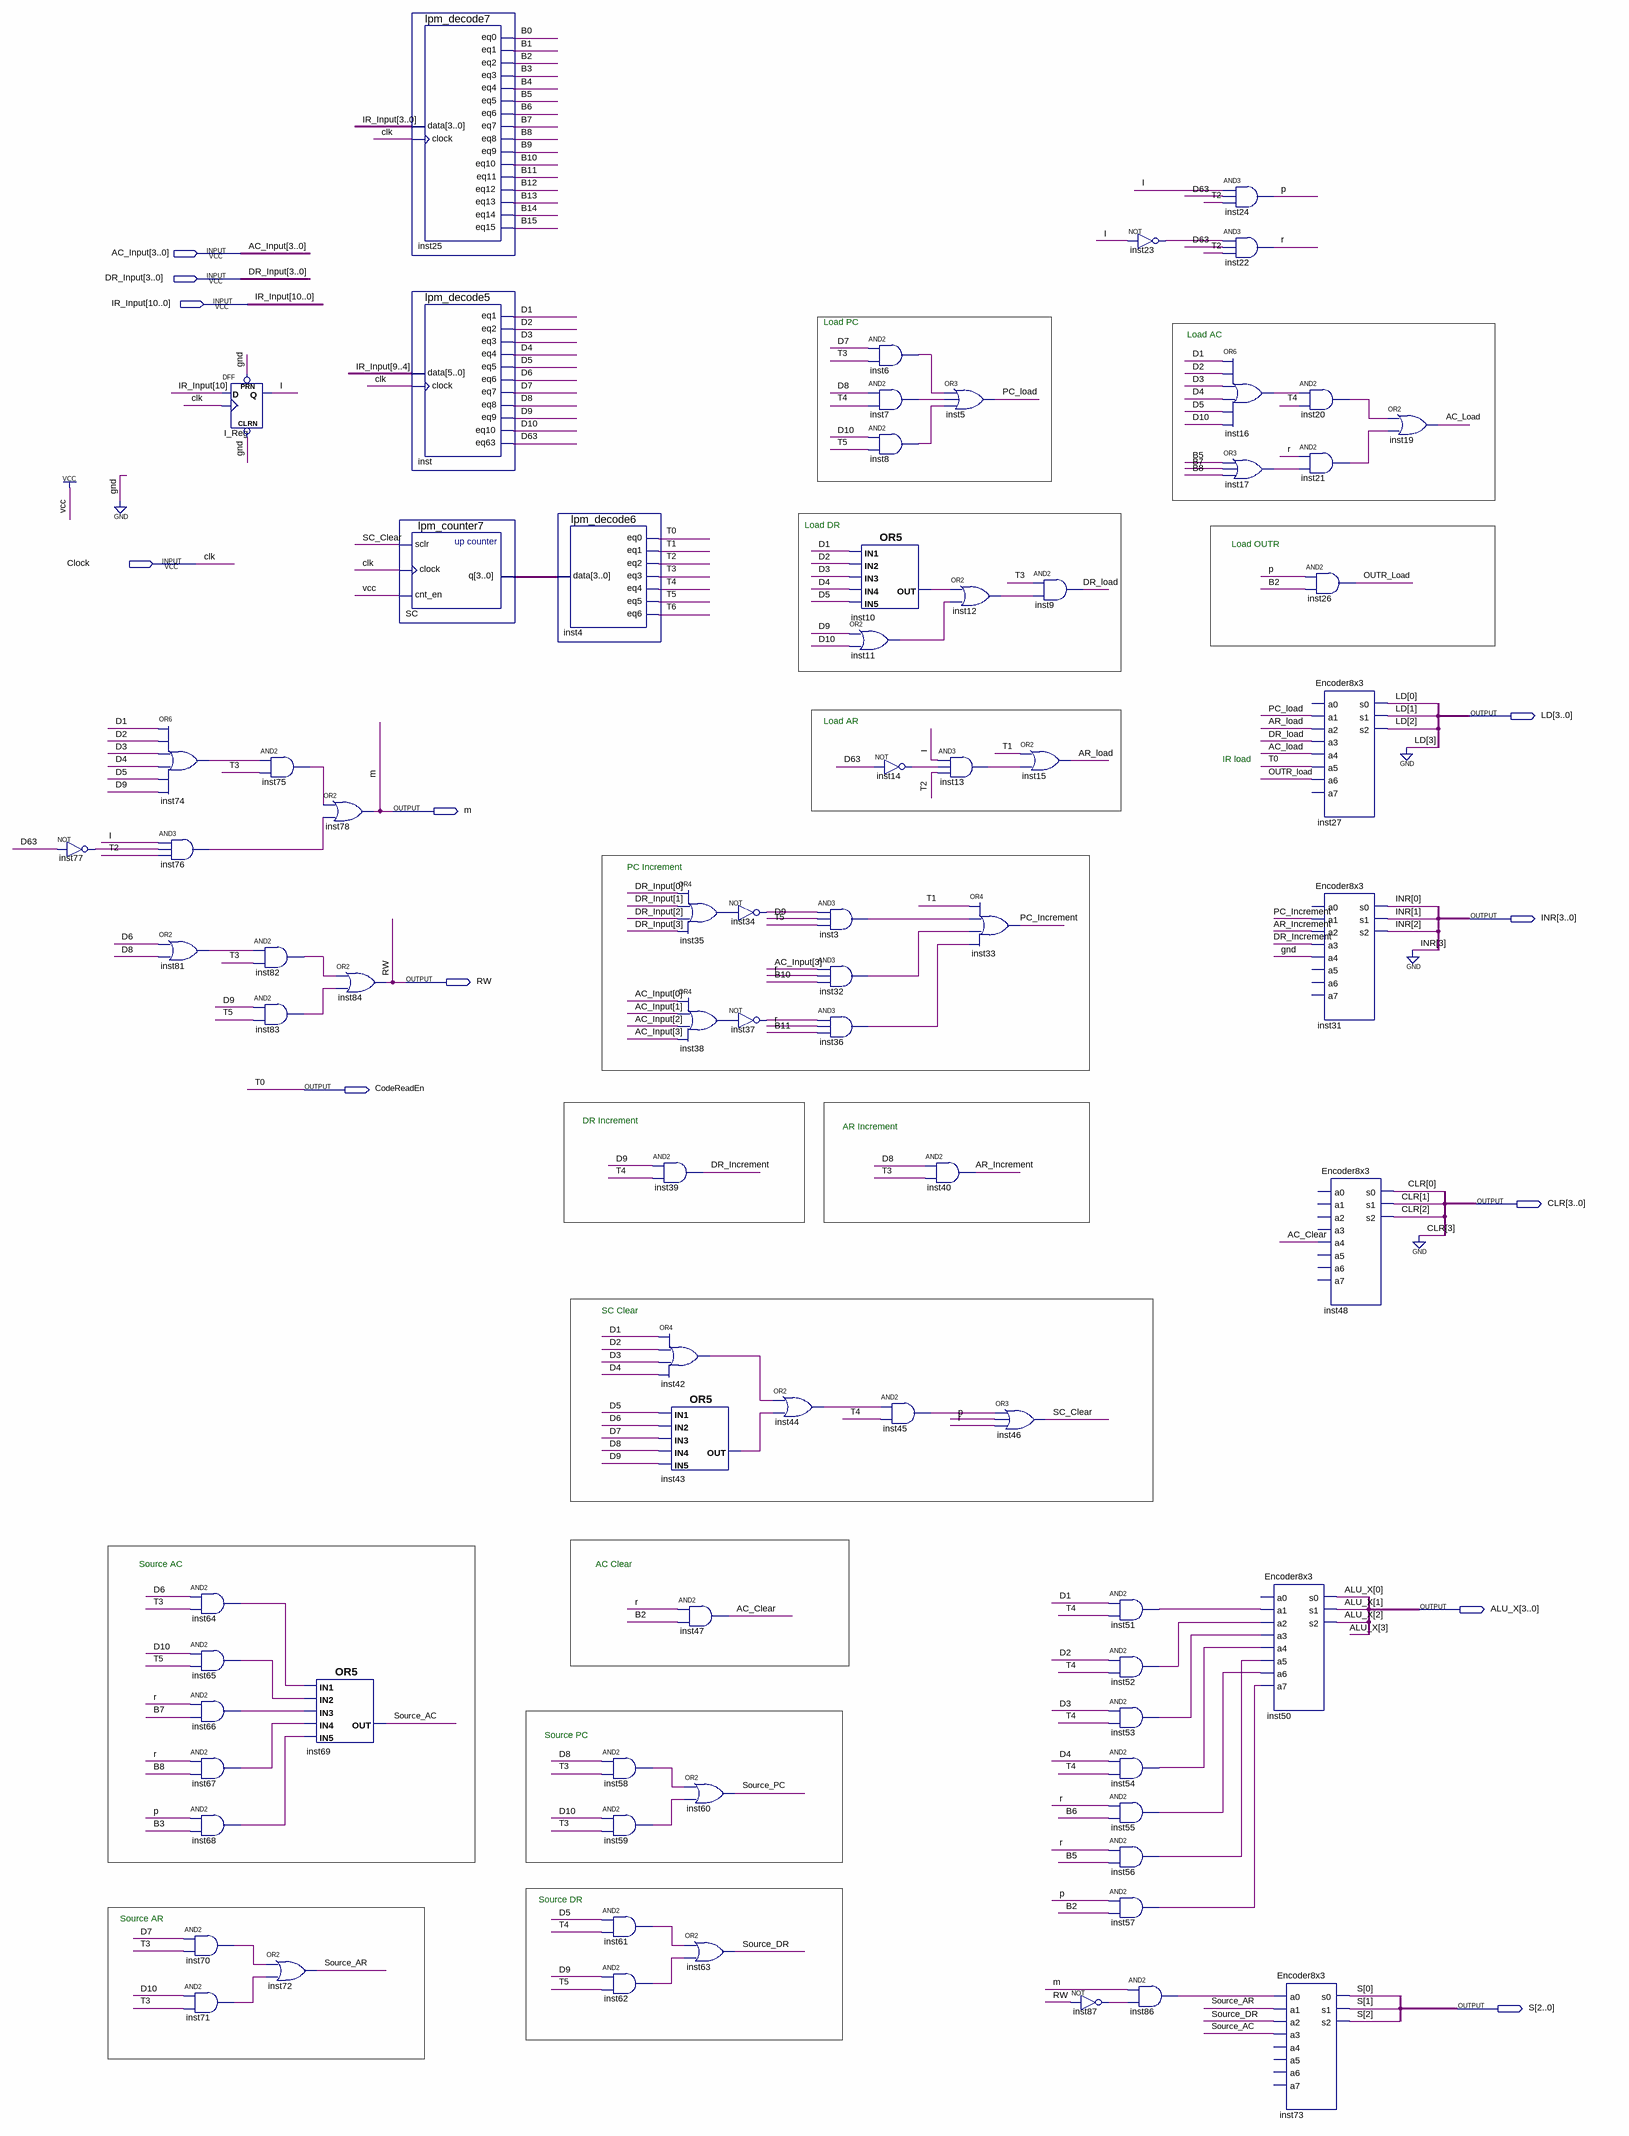
[diagram p0: schematic sheet]
// Quartus schematic CU.bdf as structural Verilog: 79 symbols, 12 pins
module CU (
  input  [3:0] AC_Input,
  input  [3:0] DR_Input,
  input  [10:0] IR_Input,
  input  Clock,
  output [3:0] LD,
  output m,
  output [3:0] INR,
  output RW,
  output CodeReadEn,
  output [3:0] CLR,
  output [3:0] ALU_X,
  output [2:0] S
);

  wire AC_Clear, AC_Load, AR_Increment, AR_load, B0, B1, B2, B3, B4, B5, B6, B7, B8, B9, B10, B11, B12, B13,
       B14, B15, D1, D2, D3, D4, D5, D6, D7, D8, D9, D10, D63, DR_Increment, DR_load, I, inst3_out,
       inst6_out, inst7_out, inst8_out, inst10_out, inst11_out, inst12_out, inst13_out, inst14_out,
       inst16_out, inst17_out, inst20_out, inst21_out, inst23_out, inst32_out, inst34_out, inst35_out,
       inst36_out, inst37_out, inst38_out, inst42_out, inst43_out, inst44_out, inst45_out, inst51_out,
       inst52_out, inst53_out, inst54_out, inst55_out, inst56_out, inst57_out, inst58_out, inst59_out,
       inst61_out, inst62_out, inst64_out, inst65_out, inst66_out, inst67_out, inst68_out, inst70_out,
       inst71_out, inst74_out, inst75_out, inst76_out, inst77_out, inst81_out, inst82_out, inst83_out,
       inst86_out, inst87_out, OUTR_Load, p, PC_Increment, PC_load, r, SC_Clear, Source_AC, Source_AR,
       Source_DR, Source_PC, T1, T2, T3, T4, T5, T6;
  wire [3:0] SC_q;

  not inst77 (inst77_out, D63);
  or inst74 (inst74_out, D1, D2, D3, D4, D5, D9);
  and inst76 (inst76_out, I, inst77_out, T2);
  or inst81 (inst81_out, D6, D8);
  and inst64 (inst64_out, D6, T3);
  and inst65 (inst65_out, D10, T5);
  and inst66 (inst66_out, r, B7);
  and inst67 (inst67_out, r, B8);
  and inst68 (inst68_out, p, B3);
  and inst70 (inst70_out, D7, T3);
  and inst71 (inst71_out, D10, T3);
  DFF I_Reg (.CLRN(1'b0), .CLK(Clock), .D(IR_Input[10]), .PRN(1'b0), .Q(I));
  and inst75 (inst75_out, inst74_out, T3);
  and inst82 (inst82_out, inst81_out, T3);
  and inst83 (inst83_out, D9, T5);
  or inst69 (Source_AC, inst64_out, inst65_out, inst66_out, inst67_out, inst68_out);
  or inst72 (Source_AR, inst70_out, inst71_out);
  or inst78 (m, inst75_out, inst76_out);
  or inst84 (RW, inst82_out, inst83_out);
  lpm_decode7 inst25 (
    .data(IR_Input[3:0]), .clock(Clock), .eq0(B0), .eq1(B1), .eq2(B2), .eq3(B3), .eq4(B4), .eq5(B5),
    .eq6(B6), .eq7(B7), .eq8(B8), .eq9(B9), .eq10(B10), .eq11(B11), .eq12(B12), .eq13(B13), .eq14(B14),
    .eq15(B15));
  lpm_decode5 inst (
    .data(IR_Input[9:4]), .clock(Clock), .eq1(D1), .eq2(D2), .eq3(D3), .eq4(D4), .eq5(D5), .eq6(D6),
    .eq7(D7), .eq8(D8), .eq9(D9), .eq10(D10), .eq63(D63));
  lpm_counter7 SC (.sclr(SC_Clear), .clock(Clock), .cnt_en(1'b1), .q(SC_q));
  lpm_decode6 inst4 (.data(SC_q), .eq0(CodeReadEn), .eq1(T1), .eq2(T2), .eq3(T3), .eq4(T4), .eq5(T5), .eq6(T6));
  and inst58 (inst58_out, D8, T3);
  and inst59 (inst59_out, D10, T3);
  and inst61 (inst61_out, D5, T4);
  and inst62 (inst62_out, D9, T5);
  and inst39 (DR_Increment, D9, T4);
  or inst42 (inst42_out, D1, D2, D3, D4);
  or inst43 (inst43_out, D5, D6, D7, D8, D9);
  or inst35 (inst35_out, DR_Input[0], DR_Input[1], DR_Input[2], DR_Input[3]);
  or inst38 (inst38_out, AC_Input[0], AC_Input[1], AC_Input[2], AC_Input[3]);
  and inst47 (AC_Clear, r, B2);
  or inst60 (Source_PC, inst58_out, inst59_out);
  or inst63 (Source_DR, inst61_out, inst62_out);
  not inst34 (inst34_out, inst35_out);
  not inst37 (inst37_out, inst38_out);
  and inst3 (inst3_out, inst34_out, D9, T5);
  and inst32 (inst32_out, AC_Input[3], r, B10);
  and inst36 (inst36_out, inst37_out, r, B11);
  or inst44 (inst44_out, inst42_out, inst43_out);
  and inst6 (inst6_out, D7, T3);
  and inst7 (inst7_out, D8, T4);
  and inst8 (inst8_out, D10, T5);
  or inst10 (inst10_out, D1, D2, D3, D4, D5);
  or inst11 (inst11_out, D9, D10);
  not inst14 (inst14_out, D63);
  and inst45 (inst45_out, inst44_out, T4);
  or inst5 (PC_load, inst6_out, inst7_out, inst8_out);
  or inst12 (inst12_out, inst10_out, inst11_out);
  and inst13 (inst13_out, I, inst14_out, T2);
  or inst33 (PC_Increment, T1, inst3_out, inst32_out, inst36_out);
  and inst40 (AR_Increment, D8, T3);
  or inst15 (AR_load, T1, inst13_out);
  or inst46 (SC_Clear, inst45_out, p, r);
  and inst9 (DR_load, T3, inst12_out);
  not inst87 (inst87_out, RW);
  and inst51 (inst51_out, D1, T4);
  and inst52 (inst52_out, D2, T4);
  and inst53 (inst53_out, D3, T4);
  and inst54 (inst54_out, D4, T4);
  and inst55 (inst55_out, r, B6);
  and inst56 (inst56_out, r, B5);
  and inst57 (inst57_out, p, B2);
  not inst23 (inst23_out, I);
  and inst86 (inst86_out, m, inst87_out);
  and inst24 (p, I, D63, T2);
  and inst22 (r, inst23_out, D63, T2);
  or inst16 (inst16_out, D1, D2, D3, D4, D5, D10);
  or inst17 (inst17_out, B5, B7, B8);
  Encoder8x3 inst50 (
    .a1(inst51_out), .a2(inst52_out), .a3(inst53_out), .a4(inst54_out), .a5(inst56_out), .a6(inst55_out),
    .a7(inst57_out), .s0(ALU_X[0]), .s1(ALU_X[1]), .s2(ALU_X[2]));  // open: a0
  Encoder8x3 inst73 (
    .a0(inst86_out), .a1(Source_AR), .a2(Source_DR), .a3(Source_AC), .s0(S[0]), .s1(S[1]), .s2(S[2]));  // open: a4, a5, a6, a7
  and inst20 (inst20_out, inst16_out, T4);
  and inst21 (inst21_out, r, inst17_out);
  and inst26 (OUTR_Load, p, B2);
  Encoder8x3 inst27 (
    .a1(PC_load), .a2(AR_load), .a3(DR_load), .a4(AC_Load), .a5(CodeReadEn), .a6(OUTR_Load), .s0(LD[0]),
    .s1(LD[1]), .s2(LD[2]));  // open: a0, a7
  Encoder8x3 inst31 (
    .a1(PC_Increment), .a2(AR_Increment), .a3(DR_Increment), .a4(1'b0), .s0(INR[0]), .s1(INR[1]), .s2(INR[2]));  // open: a0, a5, a6, a7
  Encoder8x3 inst48 (.a4(AC_Clear), .s0(CLR[0]), .s1(CLR[1]), .s2(CLR[2]));  // open: a0, a1, a2, a3, a5, a6, a7
  or inst19 (AC_Load, inst20_out, inst21_out);

  assign CLR[3] = 1'b0;
  assign INR[3] = 1'b0;
  assign LD[3] = 1'b0;

  // Other names for the same wires on the sheet: clk = Clock; T0 = CodeReadEn

  // Notes on the sheet:
  //   Load PC
  //    Load AC
  //   Load DR
  //    Load OUTR
  //   Load AR
  //   IR load
  //   PC Increment
  //   DR Increment
  //   AR Increment
  //   SC Clear
  //   Source AC
  //   AC Clear
  //   Source PC
  //   Source DR
  //   Source AR
endmodule
